# Altium schematic sheet 0070_HSIO MUXING -1.SchDoc
size 848 x 558 mm
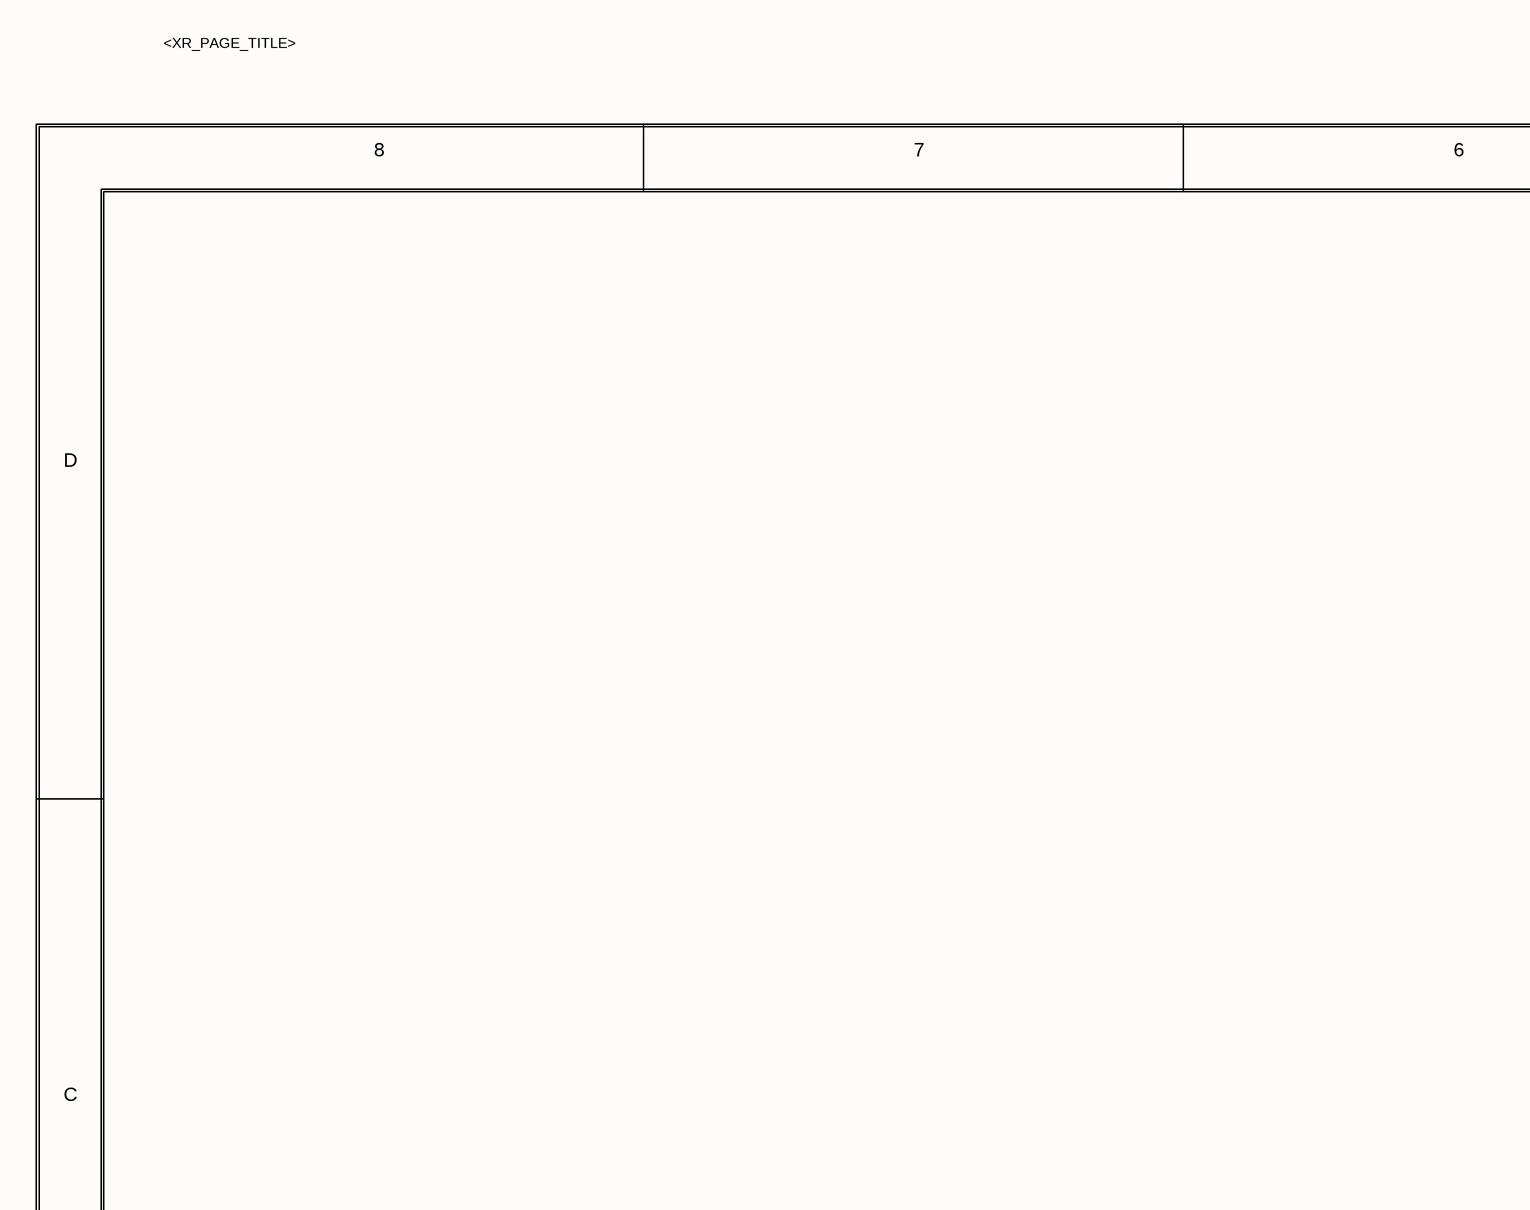
[diagram p0: 0070_HSIO MUXING -1.SchDoc, top left]
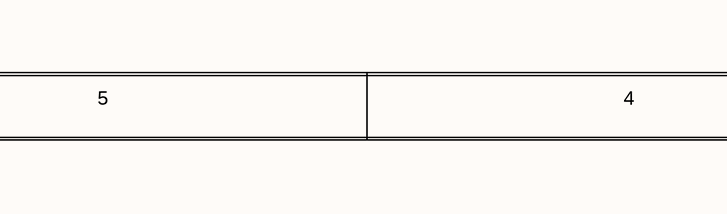
[diagram p1: 0070_HSIO MUXING -1.SchDoc, top middle]
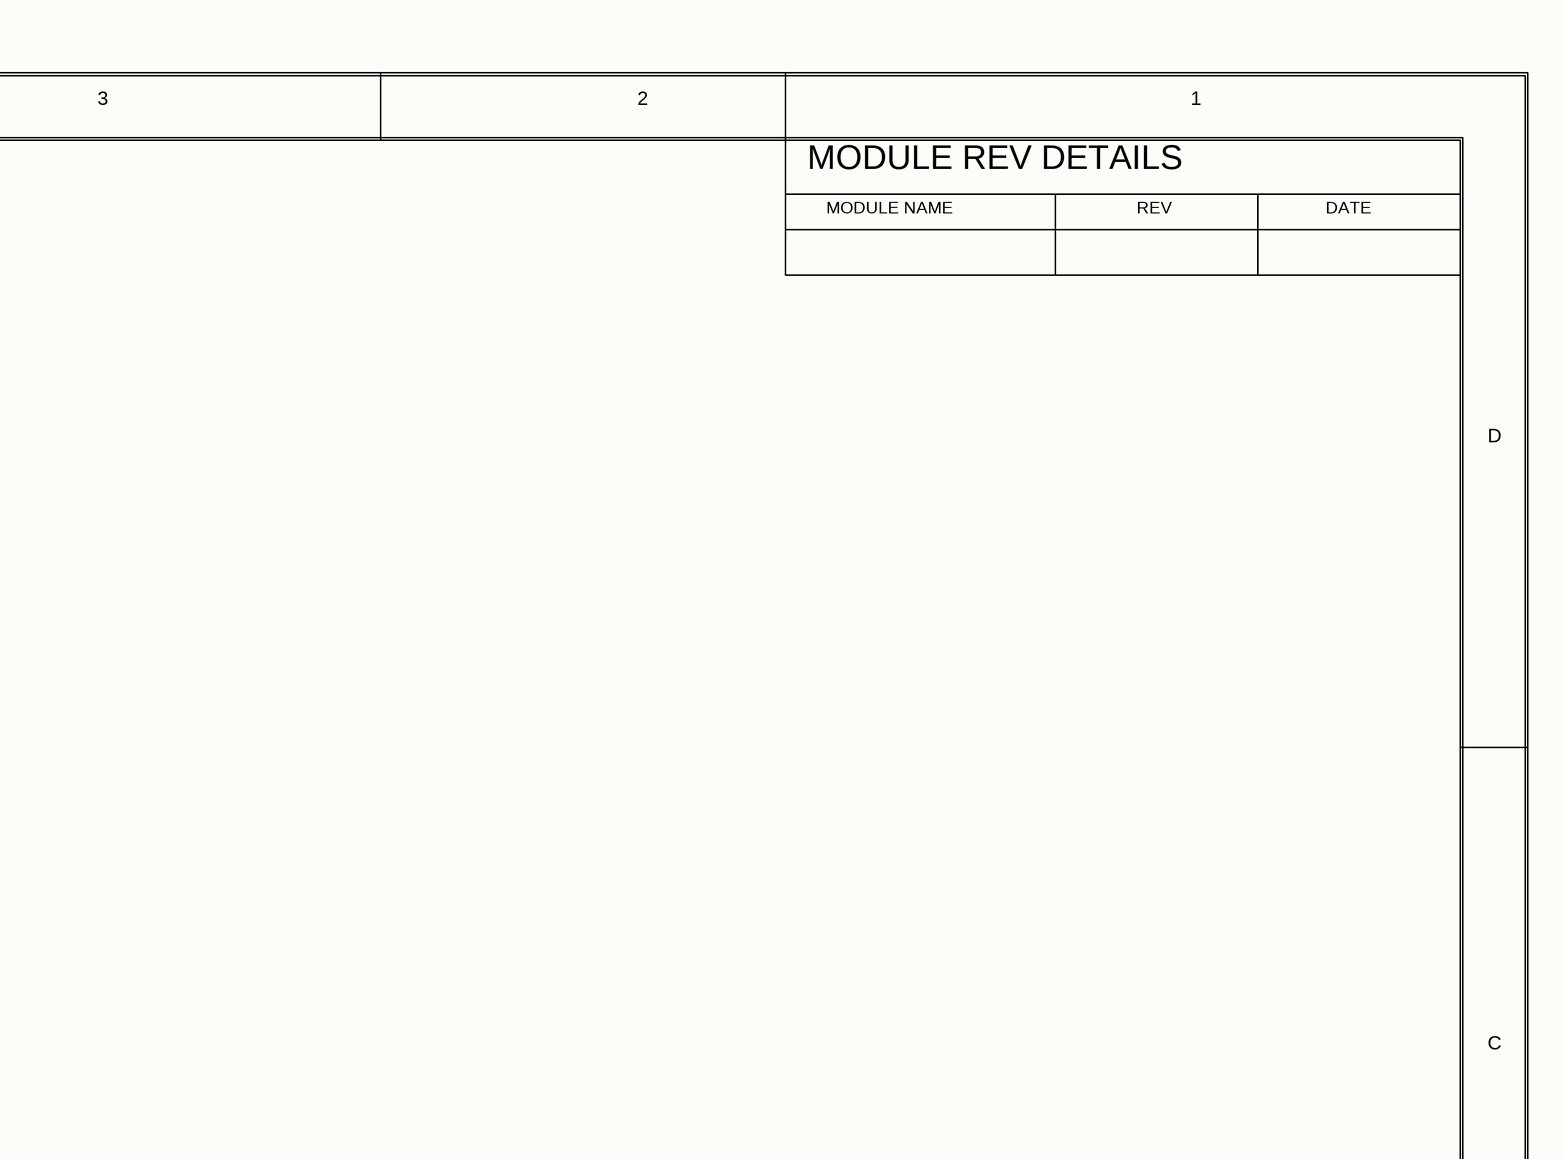
[diagram p2: 0070_HSIO MUXING -1.SchDoc, top right]
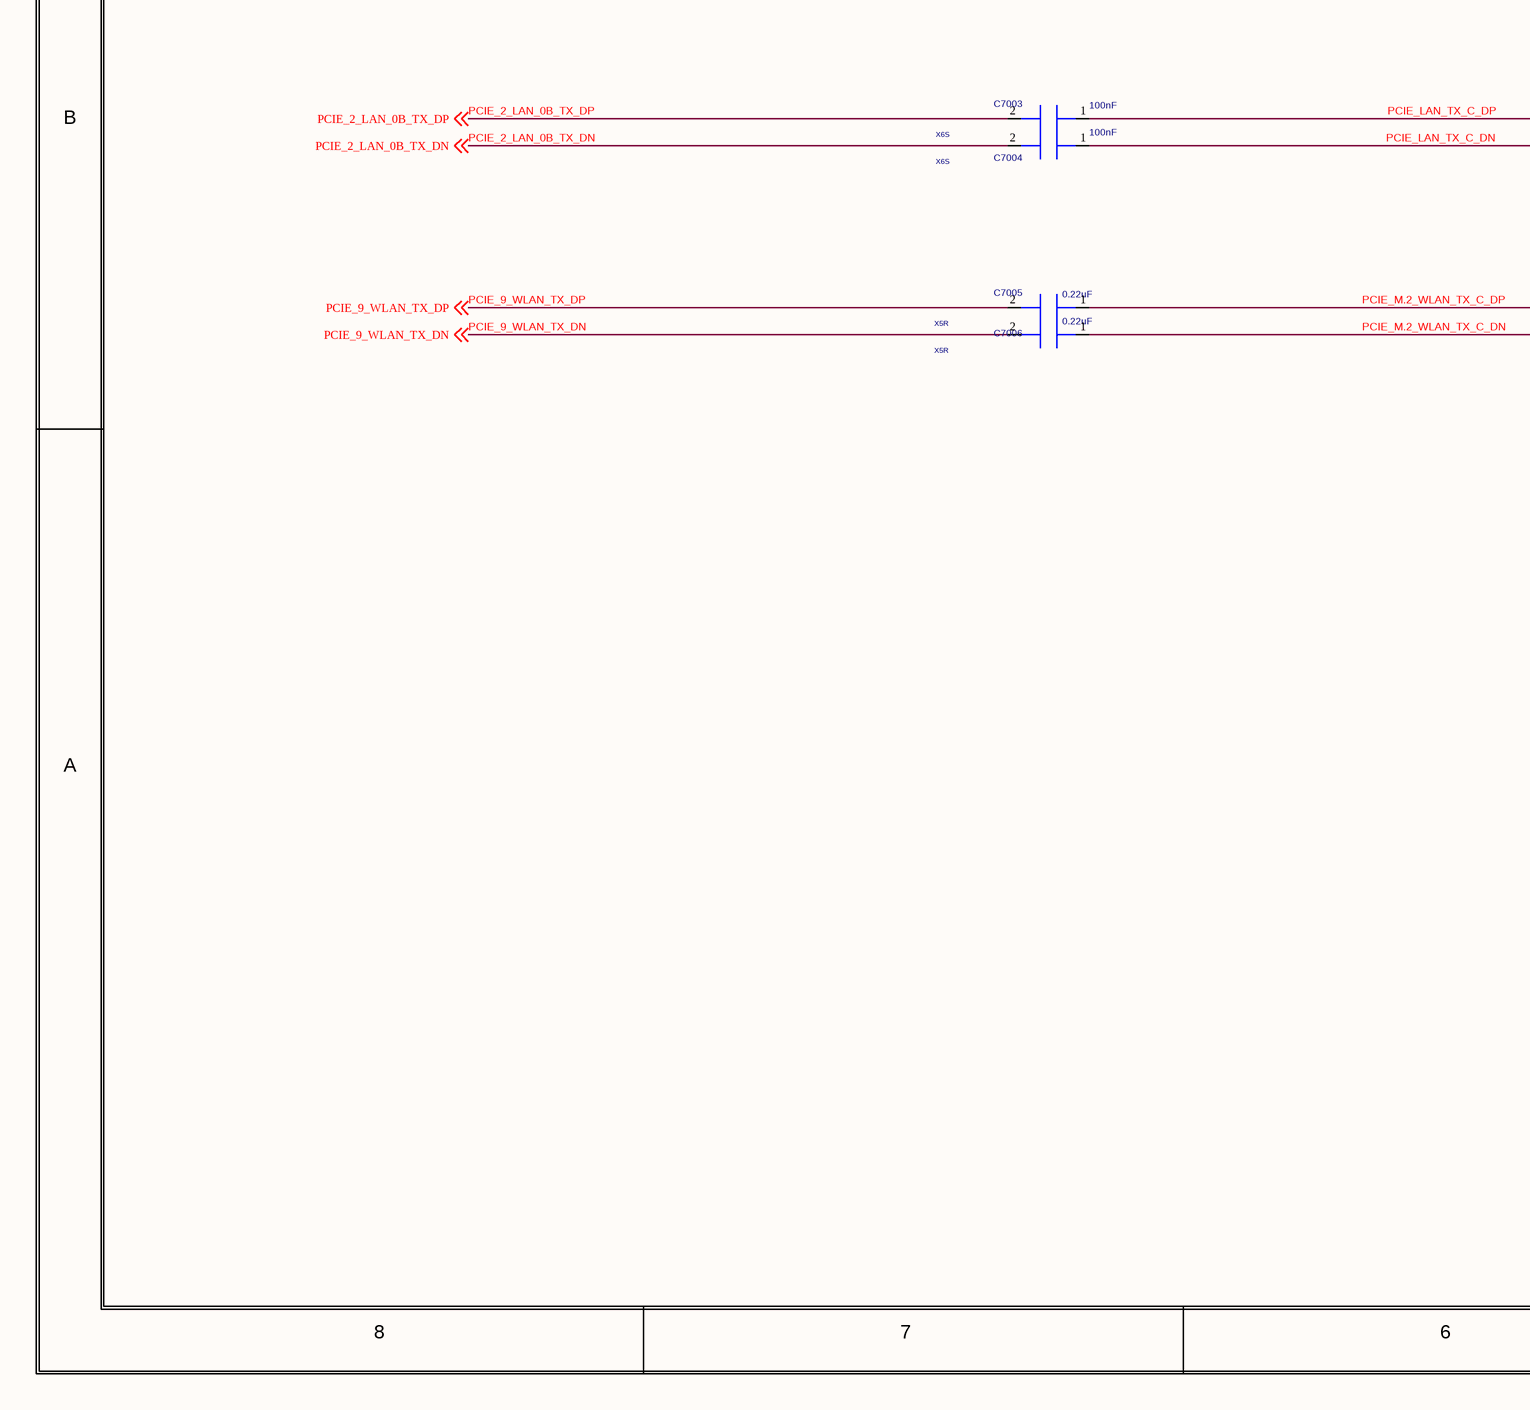
[diagram p3: 0070_HSIO MUXING -1.SchDoc, bottom left]
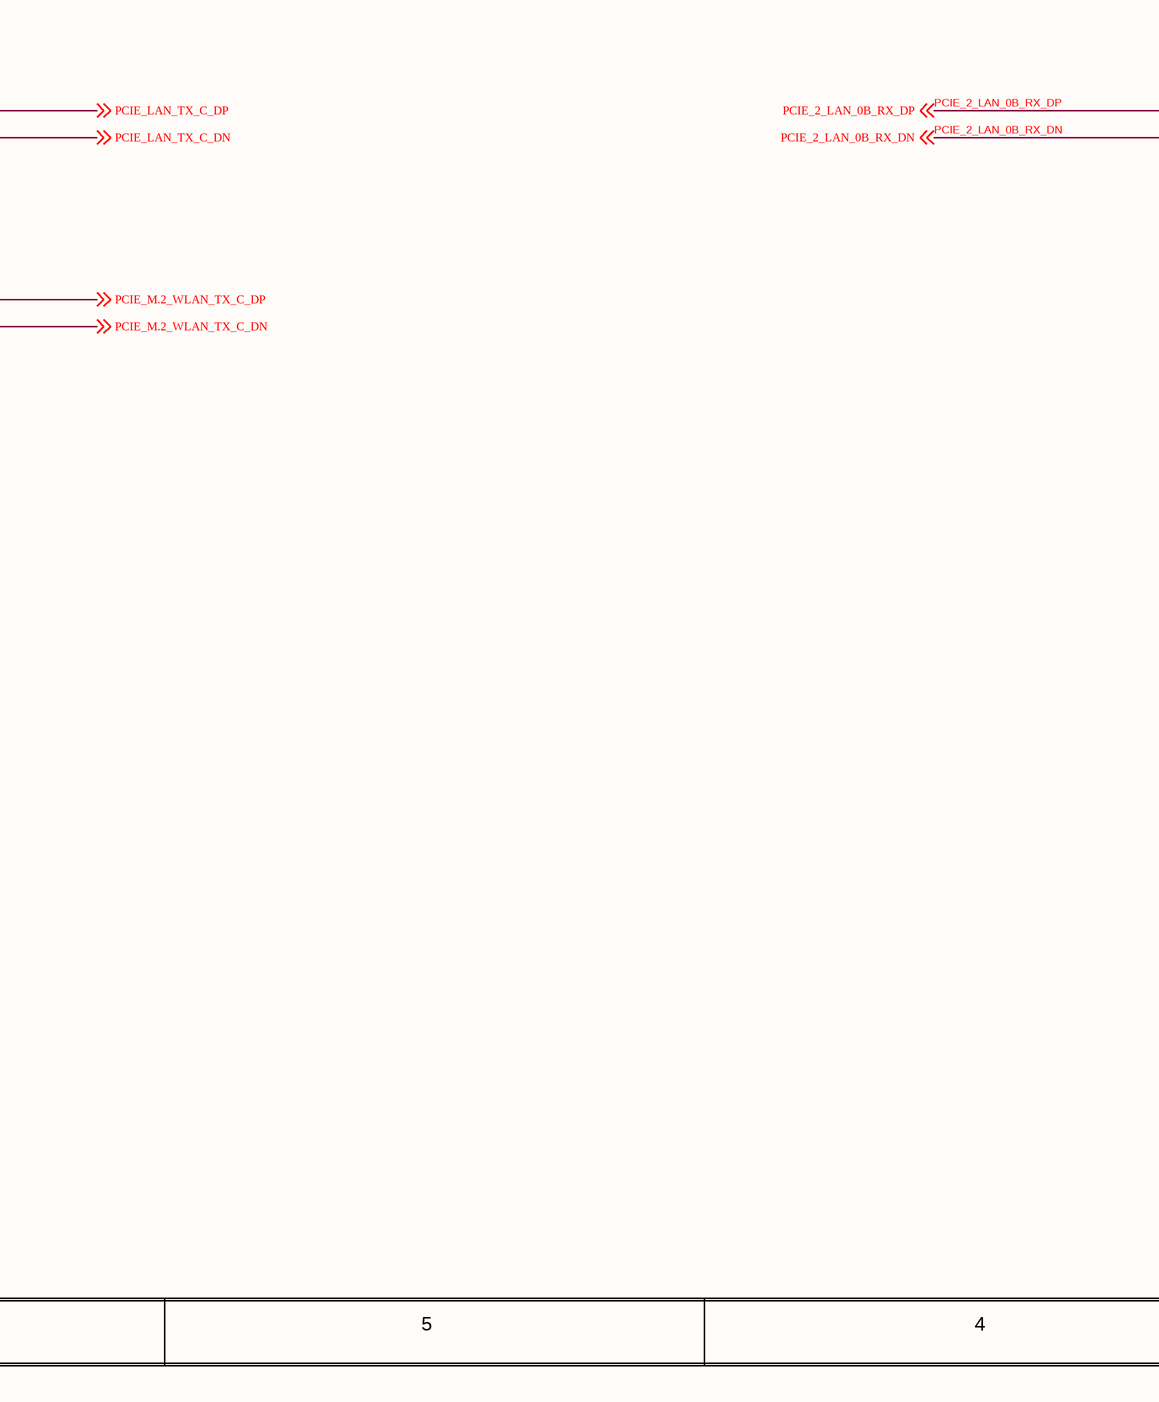
[diagram p4: 0070_HSIO MUXING -1.SchDoc, bottom middle]
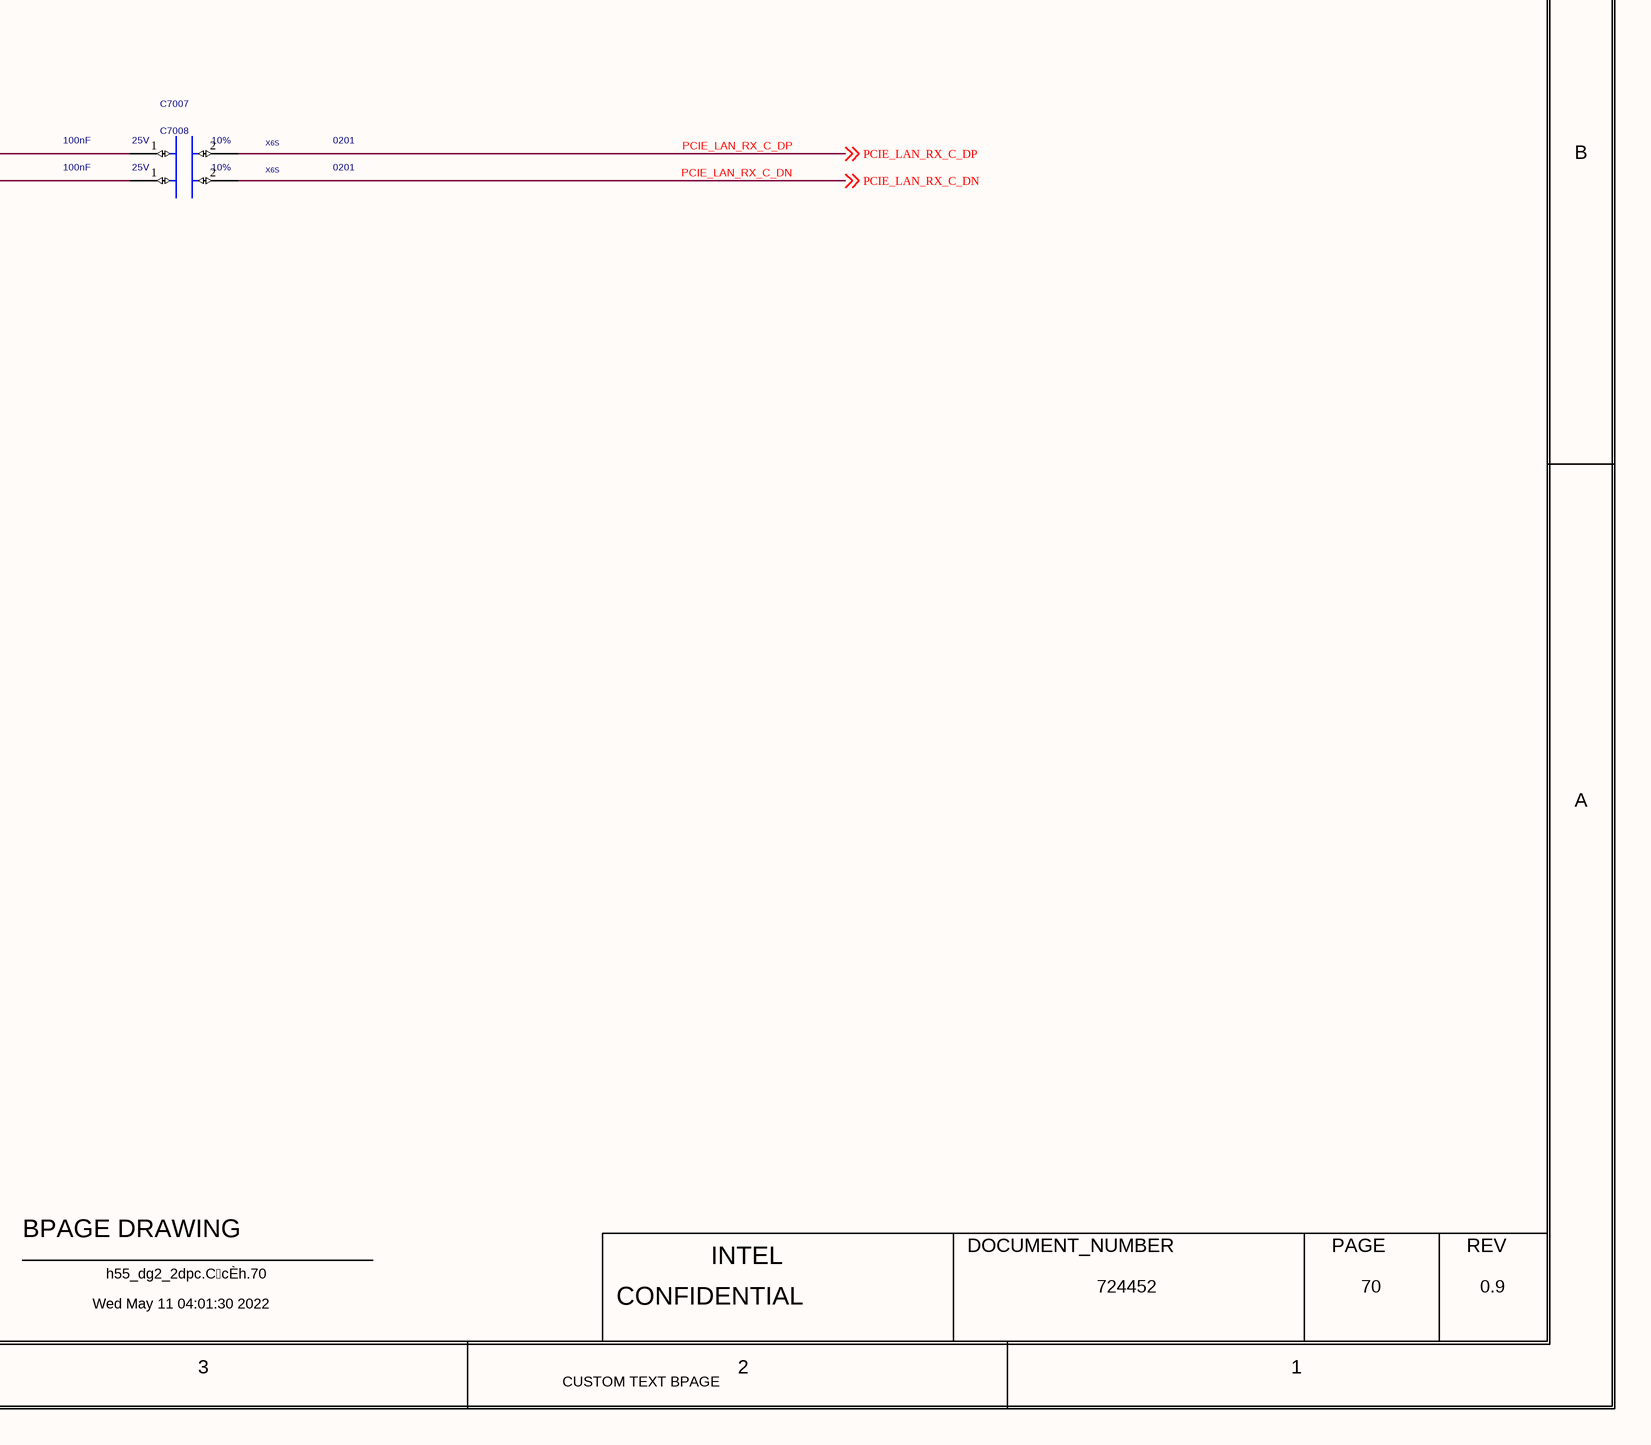
[diagram p5: 0070_HSIO MUXING -1.SchDoc, bottom right]

## Parts
C7003  100nF  MATERIAL: X6S  [SMC0201IA]
C7004  100nF  MATERIAL: X6S  [SMC0201IA]
C7005  0.22uF  MATERIAL: X5R  [SMC0201MB]
C7006  0.22uF  MATERIAL: X5R  [SMC0201MB]
C7007  100nF  MATERIAL: X6S  PACK_TYPE: 0201  TOLERANCE: 10%  VOLTAGE: 25V  [SMC0201IA]
C7008  100nF  MATERIAL: X6S  PACK_TYPE: 0201  TOLERANCE: 10%  VOLTAGE: 25V  [SMC0201IA]

## Nets
PCIE_2_LAN_0B_RX_DN: C7008.1(A) ; off-sheet PCIE_2_LAN_0B_RX_DN
PCIE_2_LAN_0B_RX_DP: C7007.1(A) ; off-sheet PCIE_2_LAN_0B_RX_DP
PCIE_2_LAN_0B_TX_DN: C7004.2(B) ; off-sheet PCIE_2_LAN_0B_TX_DN
PCIE_2_LAN_0B_TX_DP: C7003.2(B) ; off-sheet PCIE_2_LAN_0B_TX_DP
PCIE_9_WLAN_TX_DN: C7006.2(B) ; off-sheet PCIE_9_WLAN_TX_DN
PCIE_9_WLAN_TX_DP: C7005.2(B) ; off-sheet PCIE_9_WLAN_TX_DP
PCIE_LAN_RX_C_DN: C7008.2(B) ; off-sheet PCIE_LAN_RX_C_DN
PCIE_LAN_RX_C_DP: C7007.2(B) ; off-sheet PCIE_LAN_RX_C_DP
PCIE_LAN_TX_C_DN: C7004.1(A) ; off-sheet PCIE_LAN_TX_C_DN
PCIE_LAN_TX_C_DP: C7003.1(A) ; off-sheet PCIE_LAN_TX_C_DP
PCIE_M.2_WLAN_TX_C_DN: C7006.1(A) ; off-sheet PCIE_M.2_WLAN_TX_C_DN
PCIE_M.2_WLAN_TX_C_DP: C7005.1(A) ; off-sheet PCIE_M.2_WLAN_TX_C_DP

## Notes on the sheet
- <XR_PAGE_TITLE>
- 8
- 7
- 6
- 5
- 4
- 3
- 2
- 1
- MODULE REV DETAILS
- MODULE NAME
- REV
- DATE
- D
- C
- B
- A
- BPAGE DRAWING
- INTEL
- DOCUMENT_NUMBER
- PAGE
- Wed May 11 04:01:30 2022
- h55_dg2_2dpc.CcÈh.70
- CONFIDENTIAL
- 724452
- 70
- 0.9
- CUSTOM TEXT BPAGE

## Library data of the parts
C7003 = CAP#2: PART_NUMBER: H68299-001; CHIPS_PART_NAME: CAP; CDS_PHYS_PART_NAME: CAP_0201-H68299-001,X6S,100NF,25V,10%,LPDB,GENERIC; PACK_TYPE: 0201; TOLERANCE: 10%; VOLTAGE: 25V; OriginalSymbolOrigin: (-75,25); XY: (-14525,3175); VER: 4; ROT: 2; PHYS_PAGE: 70; LOCATION: C7003; IP: GENERIC; FP_TECH: LPDB; DRAWING: @RVP1_ADL_SB_ADP_S_DDR5_SODIMM_2DPC_LIB.H55_DG2_2DPC(SCH_1):PAGE70; CDS_LIB: discrete; PCB Footprint: SMC0201IA; CDS_PART_NAME: CAP_0201-H68299-001,X6S,100NF,25V,10%,LPDB,GENERIC; CDS_LOCATION: C7003; ASI_MODEL: H68299-001
C7004 = CAP#2: PART_NUMBER: H68299-001; CHIPS_PART_NAME: CAP; CDS_PHYS_PART_NAME: CAP_0201-H68299-001,X6S,100NF,25V,10%,LPDB,GENERIC; PACK_TYPE: 0201; TOLERANCE: 10%; VOLTAGE: 25V; OriginalSymbolOrigin: (-75,25); XY: (-14525,3125); VER: 4; ROT: 2; PHYS_PAGE: 70; LOCATION: C7004; IP: GENERIC; FP_TECH: LPDB; DRAWING: @RVP1_ADL_SB_ADP_S_DDR5_SODIMM_2DPC_LIB.H55_DG2_2DPC(SCH_1):PAGE70; CDS_LIB: discrete; PCB Footprint: SMC0201IA; CDS_PART_NAME: CAP_0201-H68299-001,X6S,100NF,25V,10%,LPDB,GENERIC; CDS_LOCATION: C7004; ASI_MODEL: H68299-001
C7005 = CAP#2: PART_NUMBER: K27071-001; CHIPS_PART_NAME: CAP; CDS_PHYS_PART_NAME: CAP_0201-K27071-001,X5R,0.22UF,25V,20%,LPDB,GENERIC; PACK_TYPE: 0201; TOLERANCE: 20%; VOLTAGE: 25V; OriginalSymbolOrigin: (-75,25); XY: (-14525,2825); VER: 4; ROT: 2; PHYS_PAGE: 70; LOCATION: C7005; IP: GENERIC; FP_TECH: LPDB; DRAWING: @RVP1_ADL_SB_ADP_S_DDR5_SODIMM_2DPC_LIB.H55_DG2_2DPC(SCH_1):PAGE70; CDS_LIB: discrete; PCB Footprint: SMC0201MB; CDS_PART_NAME: CAP_0201-K27071-001,X5R,0.22UF,25V,20%,LPDB,GENERIC; CDS_LOCATION: C7005; ASI_MODEL: K27071-001
C7006 = CAP#2: PART_NUMBER: K27071-001; CHIPS_PART_NAME: CAP; CDS_PHYS_PART_NAME: CAP_0201-K27071-001,X5R,0.22UF,25V,20%,LPDB,GENERIC; PACK_TYPE: 0201; TOLERANCE: 20%; VOLTAGE: 25V; OriginalSymbolOrigin: (-75,25); XY: (-14525,2775); VER: 4; ROT: 2; PHYS_PAGE: 70; LOCATION: C7006; IP: GENERIC; FP_TECH: LPDB; DRAWING: @RVP1_ADL_SB_ADP_S_DDR5_SODIMM_2DPC_LIB.H55_DG2_2DPC(SCH_1):PAGE70; CDS_LIB: discrete; PCB Footprint: SMC0201MB; CDS_PART_NAME: CAP_0201-K27071-001,X5R,0.22UF,25V,20%,LPDB,GENERIC; CDS_LOCATION: C7006; ASI_MODEL: K27071-001
C7007 = CAP#1: PART_NUMBER: H68299-001; CHIPS_PART_NAME: CAP; CDS_PHYS_PART_NAME: CAP_0201-H68299-001,X6S,100NF,25V,10%,LPDB,GENERIC; OriginalSymbolOrigin: (-25,50); XY: (-10775,3175); VER: 2; ROT: 0; PHYS_PAGE: 70; LOCATION: C7007; IP: GENERIC; FP_TECH: LPDB; DRAWING: @RVP1_ADL_SB_ADP_S_DDR5_SODIMM_2DPC_LIB.H55_DG2_2DPC(SCH_1):PAGE70; CDS_LIB: discrete; PCB Footprint: SMC0201IA; CDS_PART_NAME: CAP_0201-H68299-001,X6S,100NF,25V,10%,LPDB,GENERIC; CDS_LOCATION: C7007
C7008 = CAP#1: PART_NUMBER: H68299-001; CHIPS_PART_NAME: CAP; CDS_PHYS_PART_NAME: CAP_0201-H68299-001,X6S,100NF,25V,10%,LPDB,GENERIC; OriginalSymbolOrigin: (-25,50); XY: (-10775,3125); VER: 2; ROT: 0; PHYS_PAGE: 70; LOCATION: C7008; IP: GENERIC; FP_TECH: LPDB; DRAWING: @RVP1_ADL_SB_ADP_S_DDR5_SODIMM_2DPC_LIB.H55_DG2_2DPC(SCH_1):PAGE70; CDS_LIB: discrete; PCB Footprint: SMC0201IA; CDS_PART_NAME: CAP_0201-H68299-001,X6S,100NF,25V,10%,LPDB,GENERIC; CDS_LOCATION: C7008